# Altium schematic sheet Quad-Stage-Prototype_LED_V1.0.SchDoc: Quad Stage Prototype
size A4; PageSetup: Record=PageOptions|CenterHorizontal=True|CenterVertical=True|PrintScale=0.97|XCorrection=1.00|YCorrection=1.00|PrintKind=0|BorderSize=5000000|LeftOffset=0|BottomOffset=0|Orientation=2|PaperLength=1000|PaperWidth=1000|Scale=100|PaperSource=7|PrintQuality=-3|MediaType=1|DitherType=10|PrintScaleMode=1|PaperKind=A4|PaperIndex=9; Organization: Ostschweizer Fachhochschule; Address2: Florian Baumgartner & Thierry Schwaller; Address3: florian.baumgartner@ost.ch; DocumentNumber: 5; Revision: V1.0; SheetNumber: 5; SheetTotal: 5; Author: Florian Baumgartner & Thierry Schwaller; Subtitle: LEDs
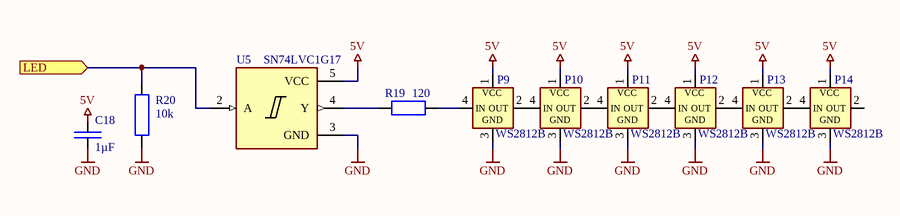
[diagram p0: Quad-Stage-Prototype_LED_V1.0.SchDoc]

## Parts
C18  1µF  [SMD Keramikkondensator 0603]
P9  WS2812B  [SMD LED WS2812B-5050]
P10  WS2812B  [SMD LED WS2812B-5050]
P11  WS2812B  [SMD LED WS2812B-5050]
P12  WS2812B  [SMD LED WS2812B-5050]
P13  WS2812B  [SMD LED WS2812B-5050]
P14  WS2812B  [SMD LED WS2812B-5050]
R19  120  [SMD Widerstand 0603]
R20  10k  [SMD Widerstand 0603]
U5  SN74LVC1G17  [SMD IC SOT-363 (SC-70-5)]

## Ports
LED (in)

## Nets
5V: C18.2 P9.1(VCC) P10.1(VCC) P11.1(VCC) P12.1(VCC) P13.1(VCC) P14.1(VCC) U5.5(VCC)
GND: C18.1 P9.3(GND) P10.3(GND) P11.3(GND) P12.3(GND) P13.3(GND) P14.3(GND) R20.1 U5.3(GND)
LED: R20.2 U5.2(A) ; port LED
NetP9_2: P9.2(OUT) P10.4(IN)
NetP9_4: P9.4(IN) R19.1
NetP10_2: P10.2(OUT) P11.4(IN)
NetP11_2: P11.2(OUT) P12.4(IN)
NetP12_2: P12.2(OUT) P13.4(IN)
NetP13_2: P13.2(OUT) P14.4(IN)
NetR19_2: R19.2 U5.4(Y)

Not connected (* = marked no-connect by the designer): P14 2(OUT); U5 1(NC)

## Notes on the sheet
- Title
- Author:
- Subtitle
- Date:
- Rev:
- File:
- Sheet
- of

## Library data of the parts
C18 = C-CAPACITOR: CAP-MK; Component Description: Multilayer Ceramic Capacitors; Component Value: 1µF 50V; Digikey: 1276-1860-1-ND; Farnell: 3013383; Mouser: 187-CL10A105KB8NNNC; JLC-Parts: C15849; Unit Price: 0.01
P9-P14 = P-WS2812B: Smart RGB-LED; aliExpress: 32550663121; Digikey: 1568-COM-16346-ND; Mouser: 474-COM-16346; JLC-Parts: C2843785; ComponentLink1Description: Datasheet; ComponentLink1URL: http://cdn.sparkfun.com/datasheets/BreakoutBoards/WS2812B.pdf; Component Description: Smart RGB-LED; Component Value: WS2812B; Unit Price: 0.10
R19 = E24 - 120: SMD Chip Resistor E24; Component Value: 120 (75V, 100mW, 1%); ComponentLink1Description: Datasheet; ComponentLink1URL: https://datasheet.lcsc.com/lcsc/1810200710_UNI-ROYAL-Uniroyal-Elec-0603WAF4701T5E_C23162.pdf; Digikey: P120HCT-ND; Farnell: 2303067; JLC-Parts: C22787; Mouser: 667-ERJ-3EKF1200V; Unit Price: 0.01; Component Description: Chip Resistor
R20 = R-RESISTOR: RES (E=Heizwiderstand B=Messwandler); Component Description: Thick Film Chip Resistor; Component Value: 10k (75V, 100mW, 1%); Digikey: P10.0KHCT-ND; Farnell: 2303192; Mouser: 667-ERJ-3EKF1002V; JLC-Parts: C25804; Unit Price: 0.01
U5 = U-SN74LVC1G17-Q1: Single Schmitt-Trigger Buffer; Digikey: 296-23709-1-ND; Farnell: 2499832; Mouser: 595-74LVC1G17QDCKRQ1; Component Description: Single Schmitt-Trigger Buffer; ComponentLink1Description: Datasheet; ComponentLink1URL: https://datasheet.lcsc.com/lcsc/1809192011_Texas-Instruments-SN74LVC1G17DCKR_C10425.pdf; Component Value: SN74LVC1G17-Q1; JLC-Parts: C10425; Unit Price: 0.36